# Altium schematic sheet 3V3_LDO.SchDoc
size A; SheetNumber: 2; SheetTotal: 8
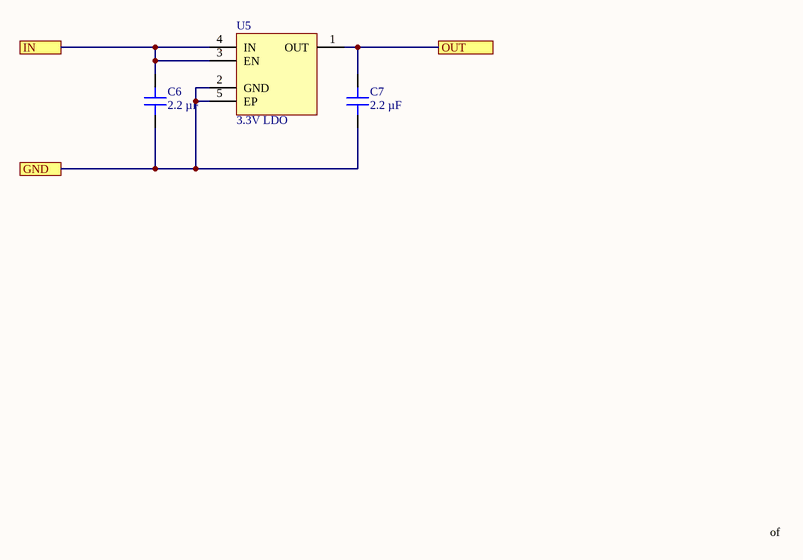
[diagram p0: 3V3_LDO.SchDoc]

## Parts
C6  2.2 µF  [CAP 0201_0603]
C7  2.2 µF  [CAP 0201_0603]
U5  3.3V LDO  [XDFN-4]

## Ports
GND, IN, OUT

## Nets
GND: C6.2 C7.2 U5.2(GND) U5.5(EP) ; port GND
IN: C6.1 U5.3(EN) U5.4(IN) ; port IN
OUT: C7.1 U5.1(OUT) ; port OUT

## Notes on the sheet
- of

## Library data of the parts
C6 C7 = GRT033R6YA104KE01D: CAP CER 0.1UF 35V X5R 0201; manufacturer: Murata Electronics; Capacitance: 0.1 µF; Tolerance: ±10%; Part Number: GRT033R6YA104KE01D; Value: 2.2 µF; Applications: Automotive; componentlink1description: Datasheet; componentlink1url: https://search.murata.co.jp/Ceramy/image/img/A01X/G101/ENG/GRT033R6YA104KE01-01.pdf; componentlink2description: DigiKey Link; componentlink2url: https://www.digikey.com/en/products/detail/murata-electronics/GRT033R6YA104KE01D/10694796; Device Package: 0201 (0603 Metric); lastupdated: 7/15/2023 7:00:43 PM; Lifecycle Status: Active; Minimum Order: 1; Mounting Type: Surface Mount, MLCC; Operating Temperature: -55°C ~ 85°C; Package / Case: 0201 (0603 Metric); packaging: TapeAndReel; partid: 49925; Part Status: Active; price: 0.01; Ratings: AEC-Q200; series: GRT; Size / Dimension: 0.024" L x 0.012" W (0.60mm x 0.30mm); Supplier 1: DigiKey; Supplier Part Number 1: 490-GRT033R6YA104KE01DCT-ND; Temperature Coefficient: X5R; Thickness (Max): 0.013" (0.33mm); Voltage - Rated: 35V
U5 = TLV74033PDQNR